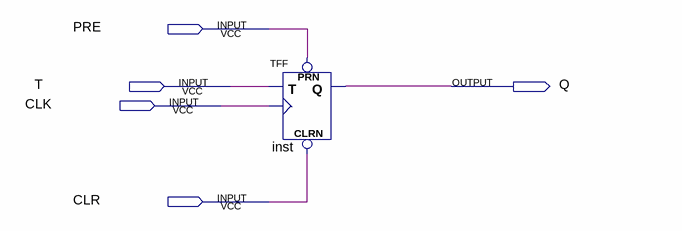
[diagram p0: schematic sheet]
// Quartus schematic TAM.bdf as structural Verilog: 1 symbols, 5 pins
module TAM (
  input  PRE,
  input  T,
  input  CLK,
  input  CLR,
  output Q
);

  TFF inst (.PRN(PRE), .CLRN(CLR), .T(T), .CLK(CLK), .Q(Q));
endmodule
